# Altium schematic sheet FOTA.SchDoc
size A3
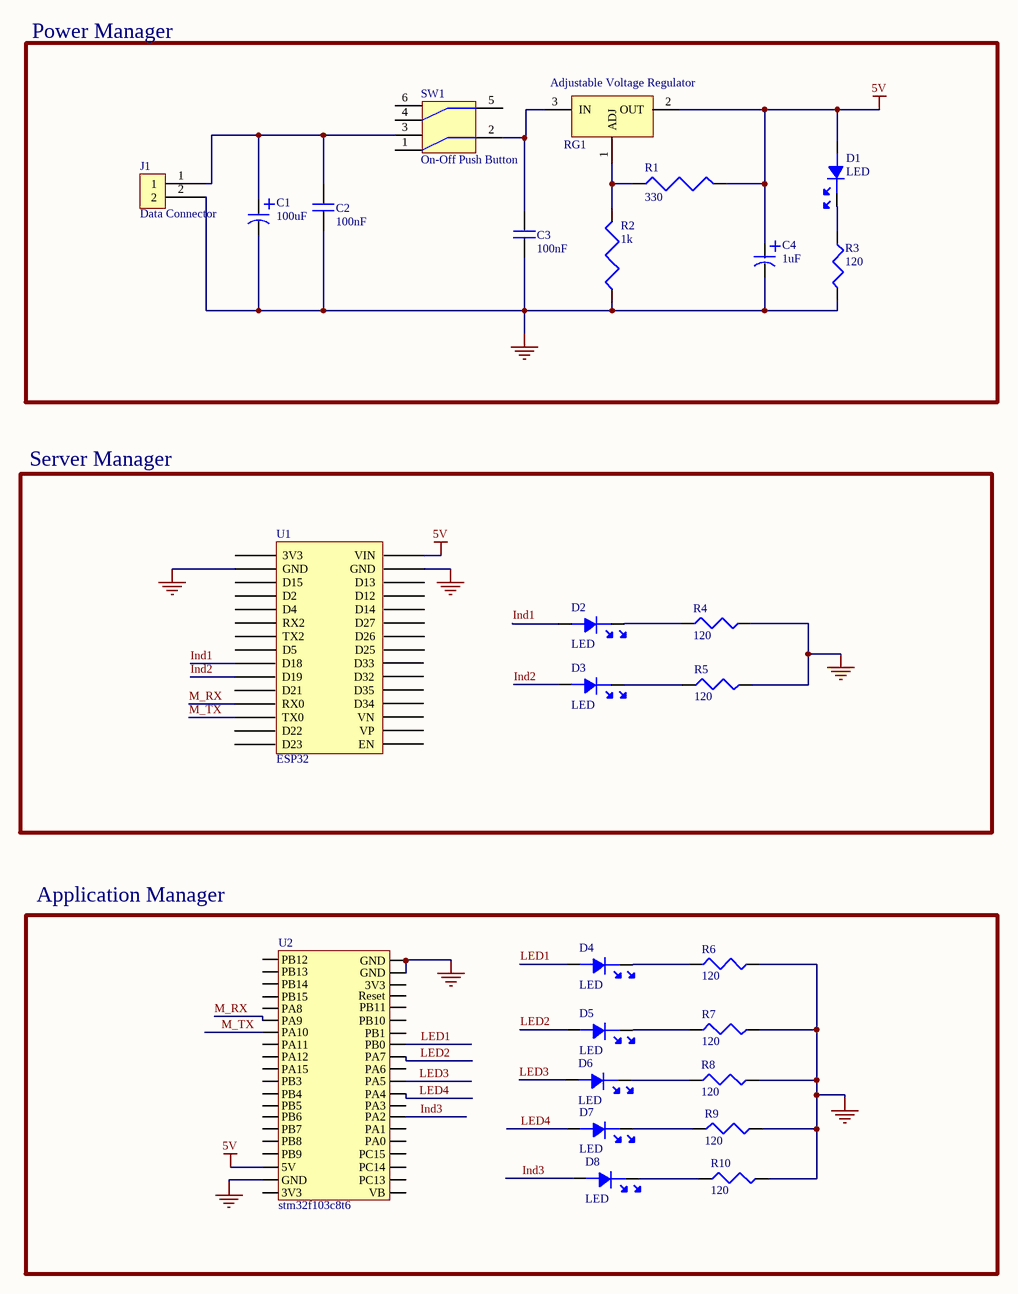
[diagram p0: FOTA.SchDoc]

## Parts
C1  100uF  [CapacitorPOL]
C2  100nF  [CAP non]
C3  100nF  [CAP non]
C4  1uF  [CapacitorPOL]
D1  LED  [LED]
D2  LED  [LED]
D3  LED  [LED]
D4  LED  [LED]
D5  LED  [LED]
D6  LED  [LED]
D7  LED  [LED]
D8  LED  [LED]
J1  Data Connector  [Data Connnector 2 pins]
R1  330  [330]
R2  1k  [R-1k]
R3  120  [R120]
R4  120  [R120]
R5  120  [R120]
R6  120  [R120]
R7  120  [R120]
R8  120  [R120]
R9  120  [R120]
R10  120  [R120]
RG1  Adjustable Voltage Regulator  [Regulator]
SW1  On-Off Push Button  [DIP6 - SW]
U1  ESP32  [ESP32]
U2  stm32f103c8t6  [DIP46]

## Blocks framed on the sheet
Power Manager: C1-C4 D1 J1 R1-R3 RG1 SW1
Server Manager: D2 D3 R4 R5 U1
Application Manager: D4-D8 R6-R10 U2

## Nets
5V: C4.1 D1.1 R1.1 RG1.2(OUT) U1.30(VIN) U2.44(5V)
GND: C1.2 C2.2 C3.2 C4.2 J1.2 R2.2 R3.1 R4.1 R5.1 R6.1 R7.1 R8.1 R9.1 R10.1 U1.2(GND) U1.29(GND) U2.19(GND) U2.20(GND) U2.45(GND)
Ind1: D2.1 U1.9(D18)
Ind2: D3.1 U1.10(D19)
Ind3: D8.1 U2.7(PA2)
LED1: D4.1 U2.13(PB0)
LED2: D5.1 U2.12(PA7)
LED3: D6.1 U2.10(PA5)
LED4: D7.1 U2.9(PA4)
M_RX: U1.12(RX0) U2.32(PA9)
M_TX: U1.13(TX0) U2.33(PA10)
NetC1_1: C1.1 C2.1 J1.1 SW1.3
NetC3_1: C3.1 RG1.3(IN) SW1.2
NetD1_2: D1.2 R3.2
NetD2_2: D2.2 R4.2
NetD3_2: D3.2 R5.2
NetD4_2: D4.2 R6.2
NetD5_2: D5.2 R7.2
NetD6_2: D6.2 R8.2
NetD7_2: D7.2 R9.2
NetD8_2: D8.2 R10.2
NetR1_2: R1.2 R2.1 RG1.1(ADJ)

Not connected (* = marked no-connect by the designer): SW1 1 4 5 6; U1 1(3V3) 3(D15) 4(D2) 5(D4) 6(RX2) 7(TX2) 8(D5) 11(D21) 14(D22) 15(D23) 16(EN) 17(VP) 18(VN) 19(D34) 20(D35) 21(D32) 22(D33) 23(D25) 24(D26) 25(D27) 26(D14) 27(D12) 28(D13); U2 1(VB) 2(PC13) 3(PC14) 4(PC15) 5(PA0) 6(PA1) 8(PA3) 11(PA6) 14(PB1) 15(PB10) 16(PB11) 17(Reset) 18(3V3) 27(PB12) 28(PB13) 29(PB14) 30(PB15) 31(PA8) 34(PA11) 35(PA12) 36(PA15) 37(PB3) 38(PB4) 39(PB5) 40(PB6) 41(PB7) 42(PB8) 43(PB9) 46(3V3)

## Library data of the parts
C1 = CAP 100u: Cap Aluminum 100uF 25V 20% (10 X 12mm) Radial Aluminum Cylindrical Can 5mm 250mA 1000 hr 150°C Bulk; Manufacturer 1: Vishay BCcomponents; Manufacturer Part Number 1: MAL216056101E3; Polarity: Polar; Ripple Current: 175mA; Impedance: 120mR; Life (Hours): 1000Hour; Supplier 1: Digi-Key; Stock 1: 2988; Pricing 1: 1=1.67000, 10=1.31800, 50=1.14220, 100=0.98840, 500=0.74680, 1000=0.65895, 2500=0.61502, 5000=0.59306 (USD); RoHS: Yes; Mount: Through Hole; Case/Package: Radial; Min Operating Temperature: -55°C; Max Operating Temperature: 150°C; Package Quantity: 1000; Packaging: Bulk; Capacitance: 100uF; Voltage Rating: 25V; Tolerance: 20%; Voltage Rating (DC): 25V; Diameter: 10mm; Height: 12mm; Lead Pitch: 0.197inch; Height - Seated (Max): 0.531inch; REACH SVHC: Unknown; RoHS Compliant: Yes; ComponentLink1URL: http://www.farnell.com/datasheets/2057608.pdf?src-supplier=Element14; ComponentLink1Description: http://www.farnell.com/datasheets/2057608.pdf?src-supplier=Element14; ComponentLink2URL: http://www.vishay.com/docs/49448/_alu_caps_smd_radial_axial_vmn-sg2185-1512.pdf?src-supplier=Digi-Key; ComponentLink2Description: http://www.vishay.com/docs/49448/_alu_caps_smd_radial_axial_vmn-sg2185-1512.pdf?src-supplier=Digi-Key; Supplier Part Number 1: 4837PHBK-ND; Category: Capacitors
C2 C3 = Non polarized capacitor: Generial Non polarized capacitor for through hole or SMD capacitors
C4 = CAP 10u: 10uF 35 V dc Aluminium Electrolytic Capacitor; BX Series 1000h 10(Dia.)x12.5mm; Manufacturer 1: Nichicon; Manufacturer Part Number 1: UBX1V100MPL; Tolerance: 20%; Ripple Current: 175mA; Voltage Rating: 35V; Leakage Current: 4uA; Life (Hours): 1000Hour; Dissipation Factor: 0.12%; Lead Diameter: 0.6mm; Supplier 1: Digi-Key; Stock 1: 5; Pricing 1: 1=1.40000, 10=1.10300, 50=0.95620, 100=0.82750, 500=0.62520, 1000=0.55166, 2500=0.51488, 5000=0.49649 (USD); RoHS: Yes; Mount: Through Hole; Case/Package: Radial; Min Operating Temperature: -55°C; Max Operating Temperature: 150°C; Capacitance: 10uF; Package Quantity: 200; Packaging: Bulk; Voltage Rating (DC): 35V; Termination: Radial; Voltage: 35V; Series: UBX; Construction: RADIAL; Diameter: 10mm; Length: 12.5mm; Height: 12.5mm; Lead Pitch: 5mm; Height - Seated (Max): 0.551inch; Radiation Hardening: No; RoHS Compliant: Yes; ComponentLink1URL: https://datasheet.ciiva.com/11778/0900766b80ec9534-11778134.pdf?src-supplier=RSComponents; ComponentLink1Description: https://datasheet.ciiva.com/11778/0900766b80ec9534-11778134.pdf?src-supplier=RSComponents; ComponentLink2URL: https://datasheet.ciiva.com/41750/444350-da-01-en-radial-elko-bx-10uf-35-v-41750976.pdf?src-supplier=Conrad; ComponentLink2Description: https://datasheet.ciiva.com/41750/444350-da-01-en-radial-elko-bx-10uf-35-v-41750976.pdf?src-supplier=Conrad; ComponentLink3URL: https://datasheet.ciiva.com/115/e-bx-115042.pdf?src-supplier=Digi-Key; ComponentLink3Description: https://datasheet.ciiva.com/115/e-bx-115042.pdf?src-supplier=Digi-Key; Category: Capacitor; Supplier Part Number 1: 493-14906-ND
D1-D8 = LED: Led, Red, T-1 (3Mm), 630 Nm, 1.8 V, 30 Ma, 20 Mcd Rohs Compliant: Yes; Manufacturer 1: Wurth Electronics; Manufacturer Part Number 1: 151031SS06000; Wavelength: 630nm; Luminous Intensity: 35mcd; Viewing Angle: 60°; Forward Voltage: 2.2V; Lens Style: Diffused,Circular,Round; Dominant Wavelength: 640nm; Test Current: 20mA; Forward Current: 30mA; Supplier 1: Digi-Key; Stock 1: 4849; Pricing 1: 1=0.18000, 50=0.16700, 100=0.14300, 500=0.12300 (USD); RoHS: Yes; Mount: Through Hole; Case/Package: Radial; Color: Red; Min Operating Temperature: -40°C; Max Operating Temperature: 85°C; Package Quantity: 1; Packaging: Bulk; Height: 5.55mm; Lens Size: 3mm; REACH SVHC: Unknown; RoHS Compliant: Yes; ComponentLink1URL: https://datasheet.ciiva.com/22657/151031ss06000-22657010.pdf?src-supplier=Element14; ComponentLink1Description: https://datasheet.ciiva.com/22657/151031ss06000-22657010.pdf?src-supplier=Element14; ComponentLink2URL: https://datasheet.ciiva.com/29335/759483-da-01-en-tht-led-3mm-superrot-151031ss06000-29335440.pdf?src-supplier=Conrad; ComponentLink2Description: https://datasheet.ciiva.com/29335/759483-da-01-en-tht-led-3mm-superrot-151031ss06000-29335440.pdf?src-supplier=Conrad; ComponentLink3URL: https://datasheet.ciiva.com/29562/151031ss06000-29562907.pdf?src-supplier=Digi-Key; ComponentLink3Description: https://datasheet.ciiva.com/29562/151031ss06000-29562907.pdf?src-supplier=Digi-Key; Supplier Part Number 1: 732-5006-ND; Category: Optoelectronics
J1 = Data Connector 2 pins
R1 = R330: General Type Carbon Film Resistor 330Ohm 1/4W 5% Axial Bulk; Manufacturer 1: Yageo; Manufacturer Part Number 1: CFR-25JB-52-330R; Resistance: 330R; Temperature Coefficient: 500ppm/°C; Max Power Dissipation: 250mW; Supplier 1: Digi-Key; Stock 1: 34290; Pricing 1: 1=0.10000, 10=0.06800, 25=0.04680, 50=0.03640, 100=0.02600, 250=0.02028, 500=0.01612, 1000=0.01144, 5000=0.00884 (USD); RoHS: Yes; Case/Package: Axial; Min Operating Temperature: -55°C; Max Operating Temperature: 155°C; Package Quantity: 200; Packaging: Bulk; Tolerance: 5%; Resistor Type: Carbon Film; Number of Terminations: 2; Series: Carbon Film; Length: 0.248inch; RoHS Compliant: Yes; ComponentLink1URL: http://www.yageo.com/NewPortal/yageodocoutput?fileName=/pdf/throughhole/Yageo_LR_CFR_2013.pdf&src-supplier=Digi-Key; ComponentLink1Description: http://www.yageo.com/NewPortal/yageodocoutput?fileName=/pdf/throughhole/Yageo_LR_CFR_2013.pdf&src-supplier=Digi-Key; Supplier Part Number 1: 330QBK-ND; Category: Resistors
R2 = R 1k: Res Carbon Film 1K Ohm 5% 1/4W -400ppm/°C to 0ppm/°C Conformal AXL Thru-Hole T/R; Manufacturer 1: Stackpole Electronics; Manufacturer Part Number 1: CF14JT1K00; Resistance: 1kR; Power Rating: 250mW; Supplier 1: Arrow Electronics; Stock 1: 285000; Pricing 1: 5000=0.00710, 10000=0.00690, 20000=0.00610 (USD); RoHS: Yes; Mount: Through Hole,Axial; Case/Package: Conformal; Contact Plating: Tin,Matte; Min Operating Temperature: -55°C; Max Operating Temperature: 155°C; Tolerance: 5%; Packaging: Tape and Reel; Package Quantity: 1; Resistor Type: Carbon Film; Temperature Coefficient: -400ppm/°C; Number of Terminations: 2; Termination: Axial; Max Power Dissipation: 250mW; Features: Flame Retardant Coating; Series: CF; Construction: Cylindrical; Diameter: 2.3mm; Length: 6.5mm; Radiation Hardening: No; Military Standard: Not; Lead Free: Lead Free; RoHS Compliant: Yes; ComponentLink1URL: http://components.arrow.com/part/dataview/27620077S9848643N1174?src-supplier=Arrow+Electronics; ComponentLink1Description: http://components.arrow.com/part/dataview/27620077S9848643N1174?src-supplier=Arrow+Electronics; ComponentLink2URL: http://www.seielect.com/Catalog/SEI-CF_CFM.pdf?src-supplier=Future+Electronics; ComponentLink2Description: http://www.seielect.com/Catalog/SEI-CF_CFM.pdf?src-supplier=Future+Electronics; ComponentLink3URL: https://www.seielect.com/catalog/SEI-CF_CFM.pdf?src-supplier=Avnet; ComponentLink3Description: https://www.seielect.com/catalog/SEI-CF_CFM.pdf?src-supplier=Avnet; ComponentLink4URL: https://www.seielect.com/catalog/SEI-Packaging.pdf?src-supplier=Digi-Key; ComponentLink4Description: https://www.seielect.com/catalog/SEI-Packaging.pdf?src-supplier=Digi-Key; ComponentLink5URL: https://www.seielect.com/Catalog/SEI-CF_CFM.pdf?src-supplier=Digi-Key; ComponentLink5Description: https://www.seielect.com/Catalog/SEI-CF_CFM.pdf?src-supplier=Digi-Key; ComponentLink6URL: https://www.verical.com/server-webapp/html/getDatasheet?partID=360403&src-supplier=Verical; ComponentLink6Description: https://www.verical.com/server-webapp/html/getDatasheet?partID=360403&src-supplier=Verical; Supplier Part Number 1: CF14JT1K00; Category: Resistors
R3-R10 = R120: General Type Carbon Film Resistor 120Ohm 1/4W 5% Axial Bulk; Manufacturer 1: Yageo; Manufacturer Part Number 1: CFR-25JB-52-120R; Resistance: 120R; Power Rating: 250mW; Temperature Coefficient: 500ppm/°C; Supplier 1: Future Electronics; Stock 1: 7000; Pricing 1: 10000=0.00860, 30000=0.00580, 50000=0.00570, 100000=0.00550, 200000=0.00540 (USD); RoHS: Yes; Case/Package: Axial; Min Operating Temperature: -55°C; Max Operating Temperature: 155°C; Tolerance: 5%; Package Quantity: 200; Packaging: Bulk; Resistor Type: Carbon Film; Number of Terminations: 2; Max Power Dissipation: 250mW; Series: Carbon Film; Length: 0.248inch; Lead Free: Lead Free; RoHS Compliant: Yes; ComponentLink1URL: http://www.yageo.com/documents/recent/General%20Type_CFR.pdf?src-supplier=Future+Electronics; ComponentLink1Description: http://www.yageo.com/documents/recent/General%20Type_CFR.pdf?src-supplier=Future+Electronics; ComponentLink2URL: http://www.yageo.com/NewPortal/yageodocoutput?fileName=/pdf/throughhole/Yageo_LR_CFR_2013.pdf&src-supplier=Digi-Key; ComponentLink2Description: http://www.yageo.com/NewPortal/yageodocoutput?fileName=/pdf/throughhole/Yageo_LR_CFR_2013.pdf&src-supplier=Digi-Key; Supplier Part Number 1: 9005903
RG1 = LM350
U2 = stm32f103c8t6: STM32 Nucleo-32 development board with STM32F031K6 MCU, supports Arduino connectivity; Manufacturer 1: STMicroelectronics; Manufacturer Part Number 1: NUCLEO-F031K6; Evaluation Kit: Yes; Number of Bits: 32; Core Architecture: ARM; Supplier 1: Avnet; Stock 1: 0; Pricing 1: 61=15.28100, 70=14.45500, 130=13.62900, 310=12.80300, 610=11.97700, 3100=11.15100, 6100=10.32500 (USD); RoHS: Yes; Package Quantity: 1; Lead Free: Lead Free; REACH SVHC: No SVHC; ComponentLink1URL: http://www.farnell.com/datasheets/1966773.pdf?src-supplier=Farnell; ComponentLink1Description: http://www.farnell.com/datasheets/1966773.pdf?src-supplier=Farnell; ComponentLink2URL: http://www.farnell.com/datasheets/1966773.pdf?src-supplier=Element14; ComponentLink2Description: http://www.farnell.com/datasheets/1966773.pdf?src-supplier=Element14; ComponentLink3URL: http://www.st.com/st-web-ui/static/active/en/resource/technical/document/user_manual/DM00119724.pdf?s_searchtype=keyword&src-supplier=Avnet; ComponentLink3Description: http://www.st.com/st-web-ui/static/active/en/resource/technical/document/user_manual/DM00119724.pdf?s_searchtype=keyword&src-supplier=Avnet; ComponentLink4URL: http://www.st.com/content/ccc/resource/technical/document/datasheet/4d/c2/7e/10/77/4f/4a/60/DM00104043.pdf/files/DM00104043.pdf/jcr:content/translations/en.DM00104043.pdf?src-supplier=Digi-Key; ComponentLink4Description: http://www.st.com/content/ccc/resource/technical/document/datasheet/4d/c2/7e/10/77/4f/4a/60/DM00104043.pdf/files/DM00104043.pdf/jcr:content/translations/en.DM00104043.pdf?src-supplier=Digi-Key; Supplier Part Number 1: NUCLEO-F031K6; Category: Development Boards, Kits, Programmers